# EAGLE design RGB_Lamp (EAGLE 9.6.2)
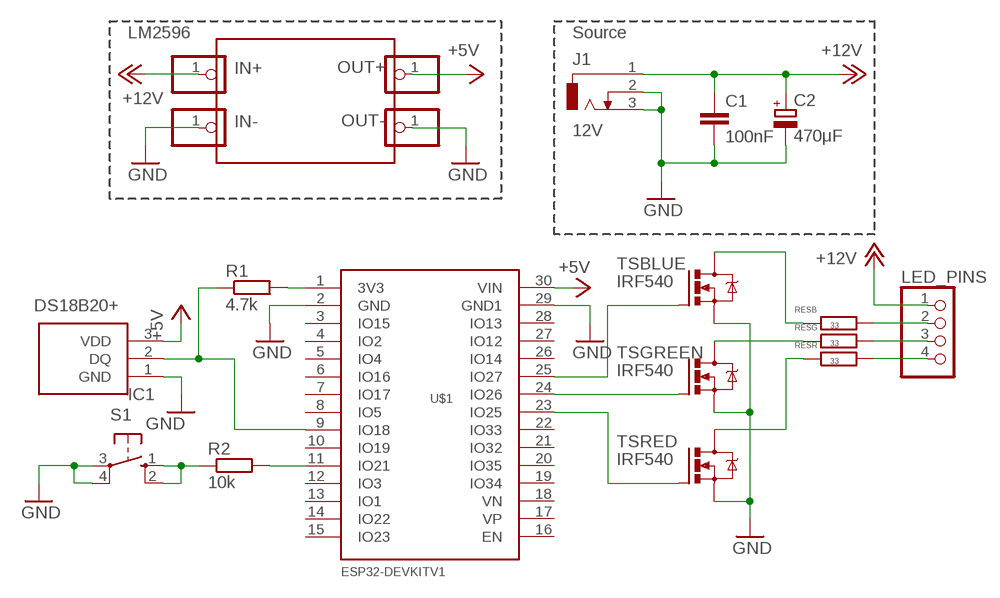
[diagram p0: schematic, sheet 1]

## Parts
C1  100nF  C-EU050-025X075  [C050-025X075]
C2  470μF  CPOL-EUE3.5-8  [E3,5-8]
IC1  DS18B20+  [DS18B20]
IN+  PINHD-1X1  [1X01]
IN-  PINHD-1X1  [1X01]
J1  12V  DCJ0303  [DCJ0303]
LED_PINS  PINHD-1X4  [1X04]
OUT+  PINHD-1X1  [1X01]
OUT-  PINHD-1X1  [1X01]
R1  4.7k  R-EU_0207/10  [0207/10]
R2  10k  R-EU_0207/10  [0207/10]
RESB  33  R-EU_0922/22  [0922/22]
RESG  33  R-EU_0922/22  [0922/22]
RESR  33  R-EU_0922/22  [0922/22]
S1  10-XX  [B3F-10XX]
TSBLUE  IRF540  [TO220BV]
TSGREEN  IRF540  [TO220BV]
TSRED  IRF540  [TO220BV]
U$1  ESP32DEVKITV1  [ESP32-DEVKITV1]

## Nets
+5V: IC1.3(VDD) OUT+.1 U$1.30(VIN)
+12V [POWER]: C1.1 C2.+ IN+.1 J1.1 LED_PINS.1
B: RESR.1 TSRED.D
GND [POWER]: C1.2 C2.- IC1.1(GND) IN-.1 J1.2 J1.3 OUT-.1 S1.3(P) S1.4(P1) TSBLUE.S TSGREEN.S TSRED.S U$1.2(GND) U$1.29(GND1)
N$1: R2.1 S1.1(S) S1.2(S1)
N$2: IC1.2(DQ) R1.1 U$1.9(IO18)
N$3: RESG.1 TSGREEN.D
N$4: R2.2 U$1.11(IO21)
N$5: LED_PINS.2 RESB.2
N$6: LED_PINS.3 RESG.2
N$7: LED_PINS.4 RESR.2
N$8: TSRED.G U$1.23(IO25)
N$9: TSGREEN.G U$1.24(IO26)
N$10: TSBLUE.G U$1.25(IO27)
N$11: R1.2 U$1.1(3V3)
R: RESB.1 TSBLUE.D
Unconnected: U$1.3(IO15) U$1.4(IO2) U$1.5(IO4) U$1.6(IO16) U$1.7(IO17) U$1.8(IO5) U$1.10(IO19) U$1.12(IO3) U$1.13(IO1) U$1.14(IO22) U$1.15(IO23) U$1.16(EN) U$1.17(VP) U$1.18(VN) U$1.19(IO34) U$1.20(IO35) U$1.21(IO32) U$1.22(IO33) U$1.26(IO14) U$1.27(IO12) U$1.28(IO13)

## Notes on the sheet
- LM2596 | Source

## Library data of the parts
C1 = rcl:C-EU: CAPACITOR, European symbol; SPICEPREFIX: C
C2 = rcl:CPOL-EU: POLARIZED CAPACITOR, European symbol; SPICEPREFIX: C
IC1 = DS18B20+:DS18B20+: Board Mount Temperature Sensors Programmable Resolution 1-Wire Digital Thermometer Source: Datasheet <https://ms.componentsearchengine.com/Datasheets/2/DS18B20 .pdf>; DESCRIPTION: Board Mount Temperature Sensors Programmable Resolution 1-Wire Digital Thermometer; HEIGHT: 4.95mm; MANUFACTURER_NAME: Maxim Integrated; MANUFACTURER_PART_NUMBER: DS18B20+; MOUSER_PART_NUMBER: 700-DS18B20+; MOUSER_PRICE-STOCK: https://www.mouser.co.uk/ProductDetail/Maxim-Integrated/DS18B20%2b?qs=7H2Jq%252ByxpJKegCKabDbglA%3D%3D
IN+ IN- OUT+ OUT- = pinhead:PINHD-1X1: PIN HEADER
J1 = con-jack:DCJ0303: DC POWER JACK Source: DCJ0303.pdf; OC_FARNELL: unknown; OC_NEWARK: unknown
LED_PINS = pinhead:PINHD-1X4: PIN HEADER
R1 R2 = rcl:R-EU_: RESISTOR, European symbol; SPICEPREFIX: R
RESB RESG RESR = Resistor_5w_33Ohm:R-EU_: RESISTOR, European symbol; SPICEPREFIX: R
S1 = switch-omron:10-XX: OMRON SWITCH; MPN: B3F-1000; OC_FARNELL: 176432; OC_NEWARK: 36M3542
TSBLUE TSGREEN TSRED = transistor-power:IRF540: HEXFET Power MOSFET
U$1 = ESP32-DEVKITV1:ESP32DEVKITV1

## Net classes
0 default: width 0.3 mm, clearance 0.205 mm
1 POWER: width 1 mm, clearance 0.205 mm to class 0, clearance 0.205 mm

## Board
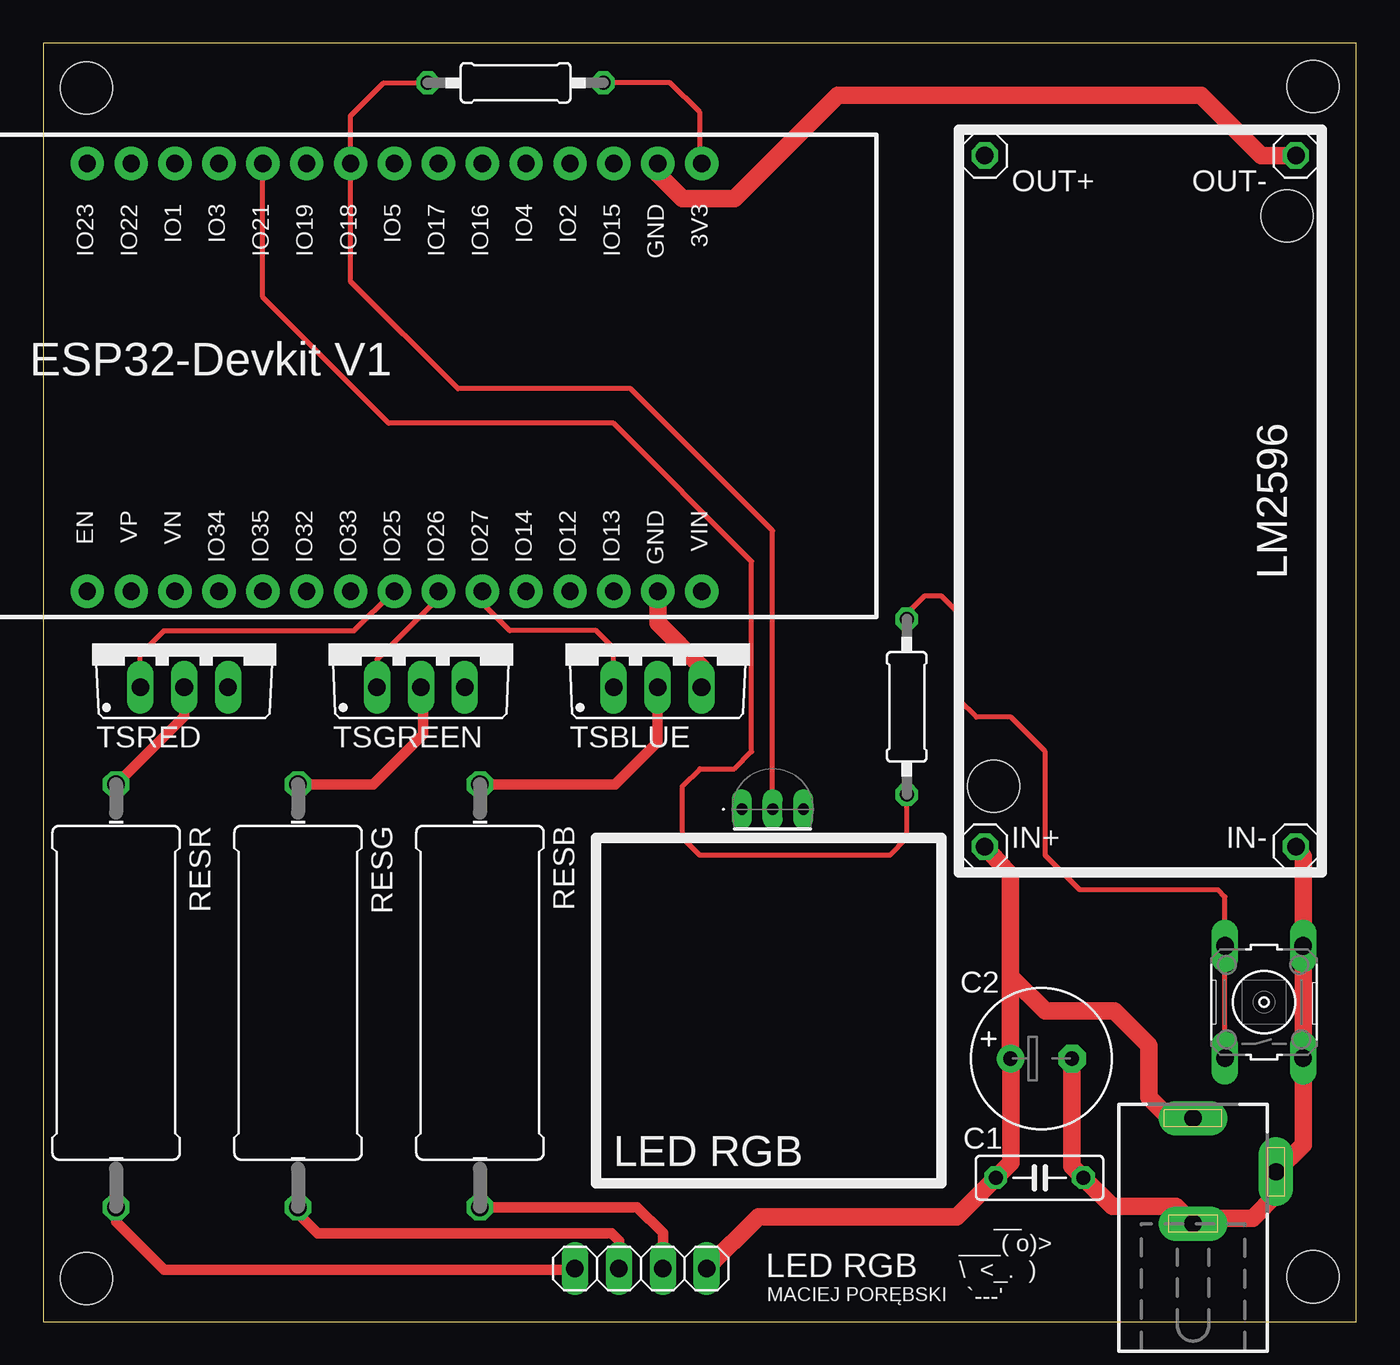
[diagram p1: board, top side]
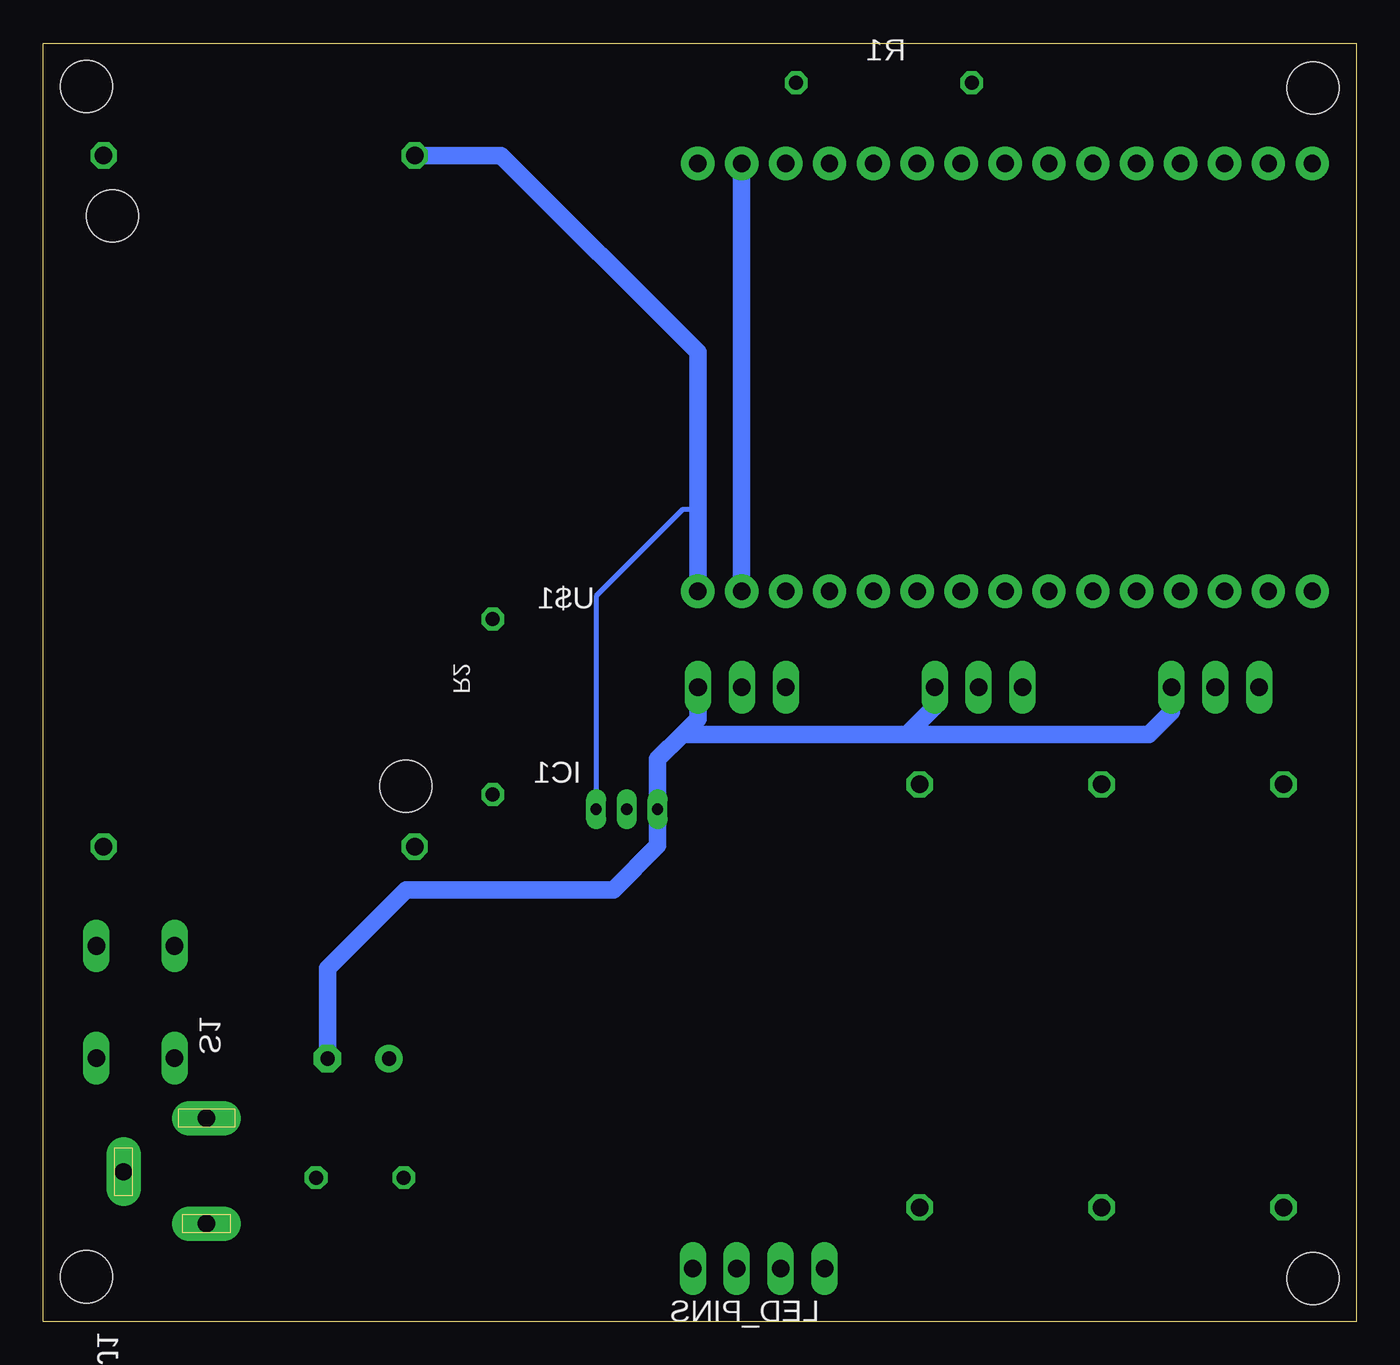
[diagram p2: board, bottom side, seen from below]

Size 76 x 74 mm. Coordinates in mm from the lower left corner, seen from the top.
Outline: 0,0 76,0 76,74 0,74 0,0
Copper layers (1*16): Top 0.035mm / dielectric 1.5mm / Bottom 0.035mm
Design rules "default": minimum track width 6mil, minimum drill 0.35mm, track to track 6mil, track to pad 6mil, pad to pad 6mil, via to via 6mil, smd to smd 6mil, copper to edge 40mil, drill to drill 6mil, minimum pad ring 10mil, minimum via ring 8mil, stop-mask expansion 4mil, vias tented up to drill 0mil, thermal gap 10mil
Holes 3 mm at 2.5,71.4 73.5,71.5 2.5,2.5 73.5,2.6 72,64 55,31

### Footprints (pad centres in the part's own frame; a part is rotated, then mirrored left to right if it is on the bottom)
C050-025X075 = drill 0.813 octagon: 1 -2.54,0; 2 2.54,0
E3,5-8 = drill 0.813 pad 1.6: + -1.778,0 | drill 0.813 pad 1.6 octagon: - 1.778,0
DS18B20 = drill 0.65 pad 1.016 long: 1 -1.778,0; 2 0,0; 3 1.778,0
1X01 = drill 1.016 octagon: 1 0,0
DCJ0303 = drill 1 pad 2 long: 1 0,3.1; 2 4.8,0; 3 0,-3
1X04 = drill 1.016 long: 1 -3.81,0; 2 -1.27,0; 3 1.27,0; 4 3.81,0
0207/10 = drill 0.813 octagon: 1 -5.08,0; 2 5.08,0
0922/22 = drill 1.016 octagon: 1 -12.43,0; 2 12.049,0
B3F-10XX = drill 1.016 long: 1 -3.251,2.261; 2 3.251,2.261; 3 -3.251,-2.261; 4 3.251,-2.261
TO220BV = drill 1.016 long: D 0,-2.54; G -2.54,-2.54; S 2.54,-2.54
ESP32-DEVKITV1 = drill 1 pad 1.93: 1 -22.87,-13.54; 2 -20.33,-13.54; 3 -17.79,-13.54; 4 -15.25,-13.54; 5 -12.71,-13.54; 6 -10.17,-13.54; 7 -7.63,-13.54; 8 -5.09,-13.54; 9 -2.55,-13.54; 10 -0.01,-13.54; 11 2.53,-13.54; 12 5.07,-13.54; 13 7.61,-13.54; 14 10.15,-13.54; 15 12.69,-13.54; 16 12.69,11.23; 17 10.15,11.23; 18 7.61,11.23; 19 5.07,11.23; 20 2.53,11.23; 21 -0.01,11.23; 22 -2.55,11.23; 23 -5.09,11.23; 24 -7.63,11.23; 25 -10.17,11.23; 26 -12.71,11.23; 27 -15.25,11.23; 28 -17.79,11.23; 29 -20.33,11.23; 30 -22.87,11.23

### Placement (x,y rotation side)
C1  57.67,8.34 0 top
C2  57.77,15.23 0 top
IC1  42.22,29.66 0 top
IN+  54.5,27.5 180 top
IN-  72.5,27.5 180 top
J1  66.55,8.68 0 top
LED_PINS  34.59,3.08 180 top
OUT+  54.5,67.5 180 top
OUT-  72.5,67.5 180 top
R1  27.34,71.71 0 top
R2  49.98,35.59 270 top
RESB  25.28,18.67 270 top
RESG  14.75,18.67 270 top
RESR  4.22,18.67 270 top
S1  70.66,18.5 90 top
TSBLUE  35.56,39.26 0 top
TSGREEN  21.86,39.26 0 top
TSRED  8.16,39.26 0 top
U$1  15.24,53.5 180 top

### Tracks (layer width: path | path; a pad name or v marks a point on that pad's centre or on a via)
+5V
  Bottom 0.3: 38.11,47 39,47 44,42 IC1.3
  Bottom 1: U$1.30 38.11,47 38.11,56.11 49.49,67.49 OUT+.1
+12V
  Top 1: LED_PINS.1 41.4,6.08 52.87,6.08 C1.1 56,9.21 C2.+ 55.99,20 | IN+.1 55.99,25.86 55.99,20 | J1.1 65.22,11.78 64,13 64,16 62,18 57.99,18 55.99,20
B
  Top 0.6: RESR.1 8.16,35.04 TSRED.D
GND
  Top 1: IN-.1 72.92,26.94 S1.4 S1.3 72.92,10.25 J1.2 71.35,7.35 70,6 66.87,6 J1.3 65.55,6.68 61.87,6.68 C1.2 59.55,9 C2.- | TSBLUE.S 38.1,37.9 35.57,40.43 U$1.29 | U$1.2 35.57,66.43 37,65 40,65 46,71 67,71 70.5,67.5 OUT-.1
  Bottom 1: C2.- 59.55,20.45 55,25 43,25 40.44,27.56 IC1.1 40.44,32.56 39,34 | TSRED.S 10.7,35.3 12,34 26,34 | 39,34 26,34 | 26,34 24.4,35.6 TSGREEN.S | 39,34 38.1,34.9 TSBLUE.S | U$1.29 U$1.2
N$1
  Top 0.3: S1.1 S1.2 68.4,24.6 68,25 60,25 58,27 58,33 56,35 54,35 53,36 53,41 52,42 51,42 49.98,40.98 R2.1
N$2
  Top 0.3: R1.1 19.71,71.71 17.79,69.79 U$1.9 17.79,60.21 24,54 34,54 42.22,45.78 IC1.2
N$3
  Top 0.6: RESG.1 19.1,31.1 22,34 22,36.58 TSGREEN.D
N$4
  Top 0.3: U$1.11 12.71,59.29 20,52 33,52 41,44 41,33 40,32 38,32 37,31 37,28 38,27 49,27 50,28 50,30.49 R2.2
N$5
  Top 0.6: LED_PINS.2 35.86,5.14 34.38,6.62 RESB.2
N$6
  Top 0.6: RESG.2 14.75,6.25 15.89,5.11 32.89,5.11 33.32,4.68 LED_PINS.3
N$7
  Top 0.6: RESR.2 4.22,5.78 7,3 30.7,3 LED_PINS.4
N$8
  Top 0.3: TSRED.G 5.62,38.62 7,40 18,40 20.27,42.27 U$1.23
N$9
  Top 0.3: TSGREEN.G 19.32,38.32 22.87,41.87 U$1.24
N$10
  Top 0.3: TSBLUE.G 33.02,38.98 32,40 27,40 25.41,41.59 U$1.25
N$11
  Top 0.3: U$1.1 38,67.15 38,70 36.29,71.71 R1.2
R
  Top 0.6: RESB.1 33.1,31.1 35.56,33.56 TSBLUE.D

### Text on the board
tNames: LM2596 | LED RGB | LED RGB | MACIEJ PORĘBSKI | __ / ___( o)> / \\ <_. ) / `---'